# Altium project Level_Shield.PrjPcb
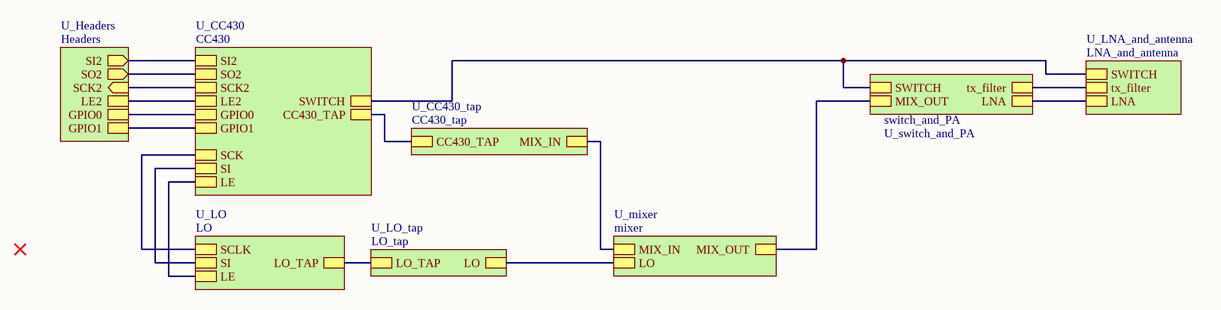
[diagram p0: Top.SchDoc]
9 sheets, 156 parts. Net scope: hierarchical (ports join the sheet entries above them; power ports are global).
Sheets:
  Top.SchDoc
    U_LNA_and_antenna = LNA_and_antenna.SchDoc
    U_switch_and_PA = switch_and_PA.SchDoc
    U_Headers = Headers.SchDoc
    U_CC430_tap = CC430_tap.SchDoc
    U_LO_tap = LO_tap.SchDoc
    U_CC430 = CC430.SchDoc
    U_LO = LO.SchDoc
    U_mixer = mixer.SchDoc

## Sheet Top.SchDoc
size A

### Sub-sheets
U_CC430 = CC430: CC430_TAP, SI, SCK, LE, SWITCH, SI2, SCK2, LE2, GPIO0, GPIO1, SO2
U_CC430_tap = CC430_tap: CC430_TAP, MIX_IN
U_Headers = Headers: SCK2 (in), SI2 (out), GPIO0, GPIO1, LE2, SO2 (out)
U_LNA_and_antenna = LNA_and_antenna: LNA, tx_filter, SWITCH
U_LO = LO: LO_TAP, SCLK, SI, LE
U_LO_tap = LO_tap: LO_TAP, LO
U_mixer = mixer: MIX_IN, MIX_OUT, LO
U_switch_and_PA = switch_and_PA: MIX_OUT, SWITCH, LNA, tx_filter

### Nets
NetC11_1: sheet U_CC430_tap/CC430_TAP, sheet U_CC430/CC430_TAP
NetC12_2: sheet U_CC430_tap/MIX_IN, sheet U_mixer/MIX_IN
NetC33_2: sheet U_LNA_and_antenna/LNA, sheet U_switch_and_PA/LNA
NetC40_2: sheet U_LNA_and_antenna/tx_filter, sheet U_switch_and_PA/tx_filter
NetC65_2: sheet U_LO_tap/LO_TAP, sheet U_LO/LO_TAP
NetC69_1: sheet U_LO_tap/LO, sheet U_mixer/LO
NetH1_1: sheet U_Headers/GPIO0, sheet U_CC430/GPIO0
NetH1_2: sheet U_Headers/GPIO1, sheet U_CC430/GPIO1
NetH1_3: sheet U_Headers/LE2, sheet U_CC430/LE2
NetH1_4: sheet U_Headers/SI2, sheet U_CC430/SI2
NetH1_5: sheet U_Headers/SO2, sheet U_CC430/SO2
NetH1_6: sheet U_Headers/SCK2, sheet U_CC430/SCK2
NetR17_1: sheet U_CC430/LE, sheet U_LO/LE
NetR18_1: sheet U_CC430/SCK, sheet U_LO/SCLK
NetR19_1: sheet U_CC430/SI, sheet U_LO/SI
NetU3_3: sheet U_LNA_and_antenna/SWITCH, sheet U_switch_and_PA/SWITCH, sheet U_CC430/SWITCH
NetU10_3: sheet U_switch_and_PA/MIX_OUT, sheet U_mixer/MIX_OUT

## Sheet LNA_and_antenna.SchDoc
size A
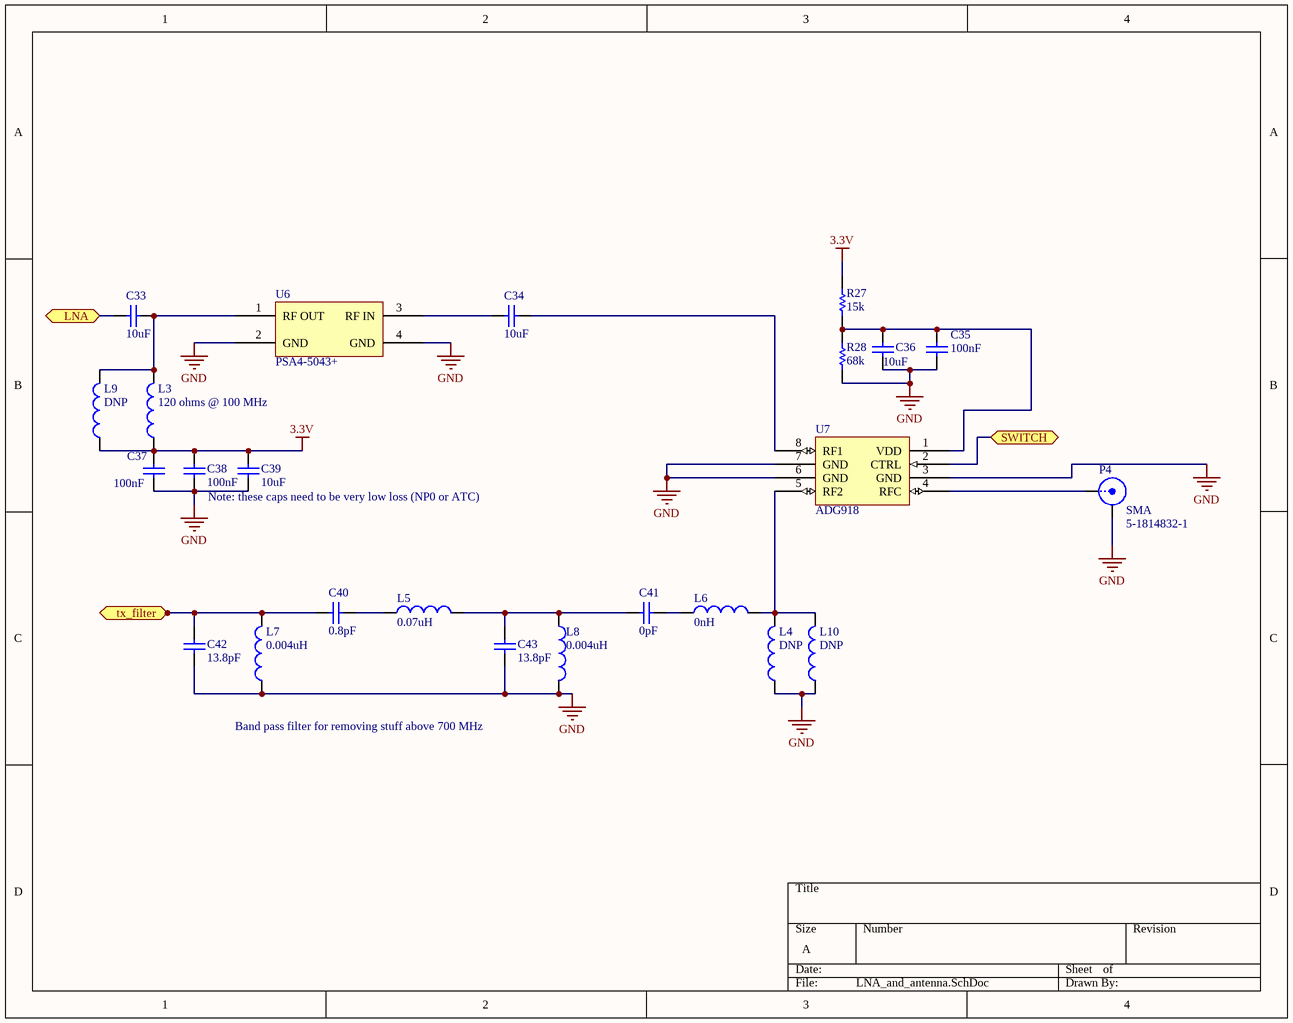
[diagram p1: LNA_and_antenna.SchDoc]

### Parts
C33  value 10uF  [0402]  (hidden comment: Cap Semi)
C34  value 10uF  [0402]  (hidden comment: Cap Semi)
C35  value 100nF  [0402]  (hidden comment: Cap Semi)
C36  value 10uF  [0402]  (hidden comment: Cap Semi)
C37  value 100nF  [0402]  (hidden comment: Cap Semi)
C38  value 100nF  [0402]  (hidden comment: Cap Semi)
C39  value 10uF  [0402]  (hidden comment: Cap Semi)
C40  value 0.8pF  [0402]  (hidden comment: Cap Semi)
C41  value 0pF  [0402]  (hidden comment: Cap Semi)
C42  value 13.8pF  [0402]  (hidden comment: Cap Semi)
C43  value 13.8pF  [0402]  (hidden comment: Cap Semi)
L3  value 120 ohms @ 100 MHz  [0402]  (hidden comment: Inductor)
L4  value DNP  [0402]  (hidden comment: Inductor)
L5  value 0.07uH  [0402]  (hidden comment: Inductor)
L6  value 0nH  [0402]  (hidden comment: Inductor)
L7  value 0.004uH  [0402]  (hidden comment: Inductor)
L8  value 0.004uH  [0402]  (hidden comment: Inductor)
L9  value DNP  [0402]  (hidden comment: Inductor)
L10  value DNP  [0402]  (hidden comment: Inductor)
P4  SMA  [SMB_V-RJ45]
R27  value 15k  [0402]  (hidden comment: Res Semi)
R28  value 68k  [0402]  (hidden comment: Res Semi)
U6  PSA4-5043+
U7  ADG918  [ADG918]

### Ports
LNA, SWITCH, tx_filter

### Nets
3.3V: C37.1 C38.1 C39.1 L3.1 L9.1 R27.1
GND: C35.1 C36.1 C37.2 C38.2 C39.2 C42.2 C43.2 L4.1 L7.1 L8.2 L10.1 P4.2(Y) R28.2 U6.2(GND) U6.4(GND) U7.3(GND) U7.6(GND) U7.7(GND)
NetC33_1: C33.1 L3.2 L9.2 U6.1(RF_OUT)
NetC33_2: C33.2 ; port LNA
NetC34_1: C34.1 U7.8(RF1)
NetC34_2: C34.2 U6.3(RF_IN)
NetC35_2: C35.2 C36.2 R27.2 R28.1 U7.1(VDD)
NetC40_1: C40.1 L5.1
NetC40_2: C40.2 C42.1 L7.2 ; port tx_filter
NetC41_1: C41.1 L6.1
NetC41_2: C41.2 C43.1 L5.2 L8.1
NetL4_2: L4.2 L6.2 L10.2 U7.5(RF2)
NetP4_1: P4.1(X) U7.4(RFC)
NetU3_3: U7.2(CTRL) ; port SWITCH

### Notes on the sheet
- Note: these caps need to be very low loss (NP0 or ATC)
- (near P4) 5-1814832-1
- Band pass filter for removing stuff above 700 MHz

### Library data of the parts
C33-C43 = Cap Semi: Capacitor (Semiconductor SIM Model); Published: 8-Jun-2000; LatestRevisionDate: 29-May-2009; LatestRevisionNote: IPC-7351 Footprint Added.; PackageReference: C1206; Publisher: Altium Limited; PackageDescription: Chip Capacitor
L3-L10 = Inductor: Code_IEC: 1005; Published: 8-Jun-2000; LatestRevisionDate: 29-May-2009; LatestRevisionNote: IPC-7351 Footprint Added.; PackageReference: 0402-A; Publisher: Altium Limited; PackageDescription: Chip Inductor; Code_JEITA: 0402
P4 = SMB: SMB Straight Connector; LatestRevisionDate: 17-Jul-2002; LatestRevisionNote: Re-released for DXP Platform.; Publisher: Altium Limited
R27 R28 = Res Semi: Semiconductor Resistor; Published: 8-Jun-2000; LatestRevisionDate: 17-Jul-2002; LatestRevisionNote: Re-released for DXP Platform.; PackageReference: AXIAL-0.5; Publisher: Altium Limited; PackageDescription: Axial Device, Thru-Hole; 2 Leads; 0.5 in Pin Spacing
U6 = PSA4-5043+: LNA
U7 = ADG918: RF Switch; Manufacturer: Analog Devices Inc; Manufacturer Part Number: ADG918BRMZ; Description: IC SW ONE HS SPDT 1.6/2.7V 8MSOP; RF Type: General Purpose; Frequency: 0Hz ~ 2GHz; ComponentLink1URL: http://www.analog.com/static/imported-files/data_sheets/ADG918_919.pdf; ComponentLink1Description: Datasheet for ADG918; Supplier 1: Digi-Key; RoHS: RoHS Compliant; Category: RF/IF and RFID; Stock 1: 5696; Pricing 1: 1=2.75, 10=2.453, 25=2.2072, 100=2.0111, 250=1.81484, 500=1.62846, 1000=1.3734, 2500=1.308 (USD); Features: SPDT; Package / Case: 8-TSSOP, 8-MSOP (0.118", 3.00mm Width); Supplier Device Package: 8-MSOP; Packaging: Tube; Supplier Part Number 1: ADG918BRMZ-ND

## Sheet switch_and_PA.SchDoc
size A
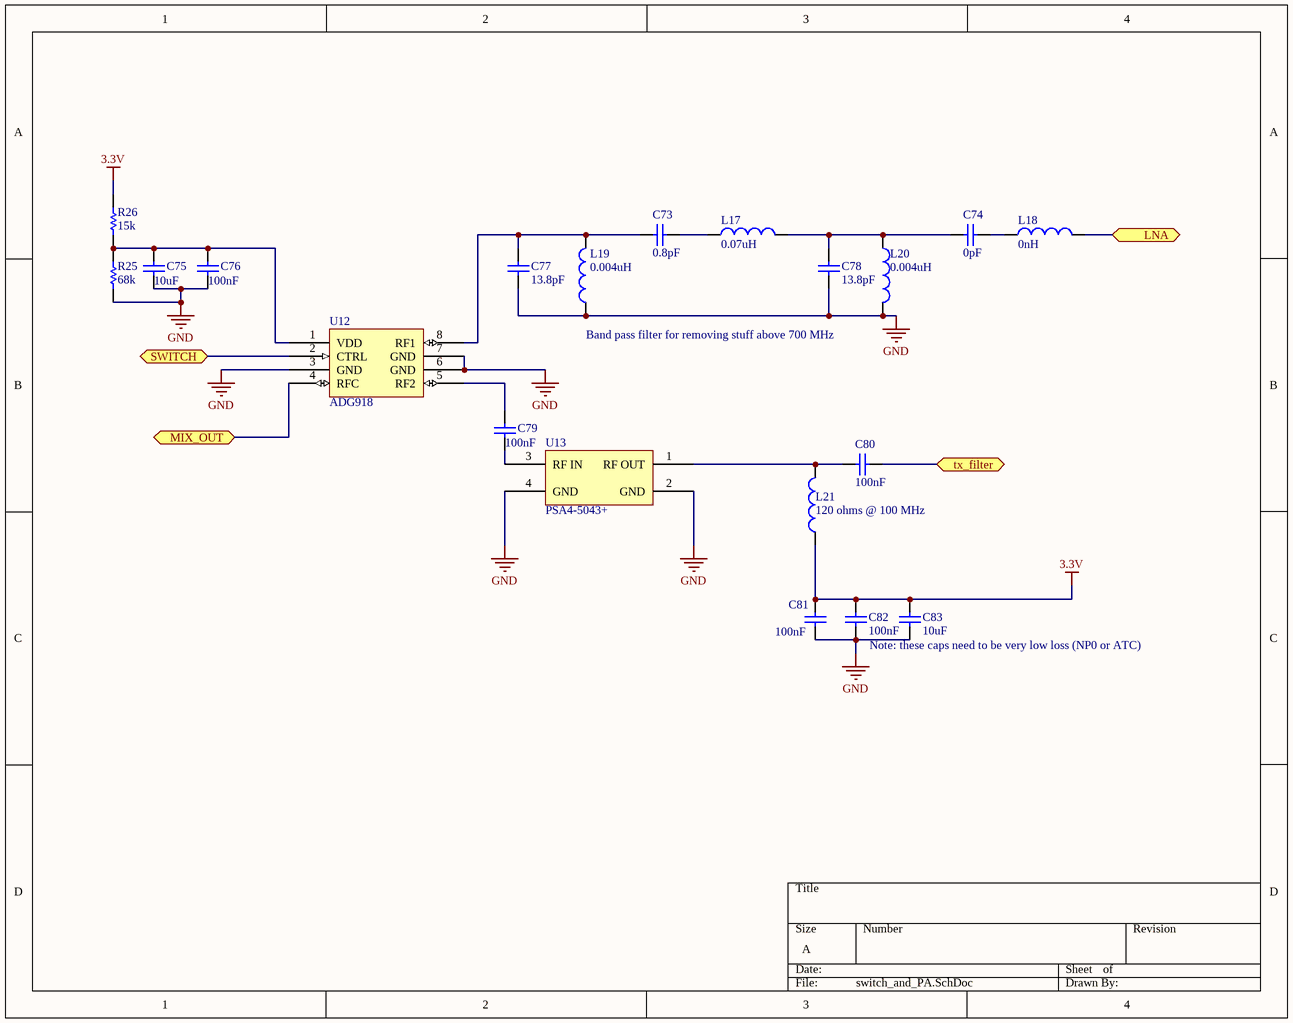
[diagram p2: switch_and_PA.SchDoc]

### Parts
C73  value 0.8pF  [0402]  (hidden comment: Cap Semi)
C74  value 0pF  [0402]  (hidden comment: Cap Semi)
C75  value 10uF  [0402]  (hidden comment: Cap Semi)
C76  value 100nF  [0402]  (hidden comment: Cap Semi)
C77  value 13.8pF  [0402]  (hidden comment: Cap Semi)
C78  value 13.8pF  [0402]  (hidden comment: Cap Semi)
C79  value 100nF  [0402]  (hidden comment: Cap Semi)
C80  value 100nF  [0402]  (hidden comment: Cap Semi)
C81  value 100nF  [0402]  (hidden comment: Cap Semi)
C82  value 100nF  [0402]  (hidden comment: Cap Semi)
C83  value 10uF  [0402]  (hidden comment: Cap Semi)
L17  value 0.07uH  [0402]  (hidden comment: Inductor)
L18  value 0nH  [0402]  (hidden comment: Inductor)
L19  value 0.004uH  [0402]  (hidden comment: Inductor)
L20  value 0.004uH  [0402]  (hidden comment: Inductor)
L21  value 120 ohms @ 100 MHz  [0402]  (hidden comment: Inductor)
R25  value 68k  [0402]  (hidden comment: Res Semi)
R26  value 15k  [0402]  (hidden comment: Res Semi)
U12  ADG918  [ADG918]
U13  PSA4-5043+

### Ports
LNA, MIX_OUT, SWITCH, tx_filter

### Nets
3.3V: C81.1 C82.1 C83.1 L21.1 R26.1
GND: C75.1 C76.1 C77.2 C78.2 C81.2 C82.2 C83.2 L19.1 L20.2 R25.2 U12.3(GND) U12.6(GND) U12.7(GND) U13.2(GND) U13.4(GND)
NetC33_2: L18.2 ; port LNA
NetC40_2: C80.1 ; port tx_filter
NetC73_1: C73.1 L17.1
NetC73_2: C73.2 C77.1 L19.2 U12.8(RF1)
NetC74_1: C74.1 L18.1
NetC74_2: C74.2 C78.1 L17.2 L20.1
NetC75_2: C75.2 C76.2 R25.1 R26.2 U12.1(VDD)
NetC79_1: C79.1 U13.3(RF_IN)
NetC79_2: C79.2 U12.5(RF2)
NetC80_2: C80.2 L21.2 U13.1(RF_OUT)
NetU3_3: U12.2(CTRL) ; port SWITCH
NetU10_3: U12.4(RFC) ; port MIX_OUT

### Notes on the sheet
- Band pass filter for removing stuff above 700 MHz
- Note: these caps need to be very low loss (NP0 or ATC)

### Library data of the parts
C73-C83 = Cap Semi: Capacitor (Semiconductor SIM Model); Published: 8-Jun-2000; LatestRevisionDate: 29-May-2009; LatestRevisionNote: IPC-7351 Footprint Added.; PackageReference: C1206; Publisher: Altium Limited; PackageDescription: Chip Capacitor
L17-L21 = Inductor: Code_IEC: 1005; Published: 8-Jun-2000; LatestRevisionDate: 29-May-2009; LatestRevisionNote: IPC-7351 Footprint Added.; PackageReference: 0402-A; Publisher: Altium Limited; PackageDescription: Chip Inductor; Code_JEITA: 0402
R25 R26 = Res Semi: Semiconductor Resistor; Published: 8-Jun-2000; LatestRevisionDate: 17-Jul-2002; LatestRevisionNote: Re-released for DXP Platform.; PackageReference: AXIAL-0.5; Publisher: Altium Limited; PackageDescription: Axial Device, Thru-Hole; 2 Leads; 0.5 in Pin Spacing
U12 = ADG918: as U7 on sheet LNA_and_antenna; ComponentLink1URL: http://www.analog.com/static/imported-files/data_sheets/ADG918_919.pdf; ComponentLink1Description: Datasheet for ADG918; Supplier 1: Digi-Key; RoHS: RoHS Compliant; Category: RF/IF and RFID; Stock 1: 5696; Pricing 1: 1=2.75, 10=2.453, 25=2.2072, 100=2.0111, 250=1.81484, 500=1.62846, 1000=1.3734, 2500=1.308 (USD); Features: SPDT; Package / Case: 8-TSSOP, 8-MSOP (0.118", 3.00mm Width); Supplier Device Package: 8-MSOP; Packaging: Tube; Supplier Part Number 1: ADG918BRMZ-ND
U13 = PSA4-5043+: LNA

## Sheet Headers.SchDoc
size A
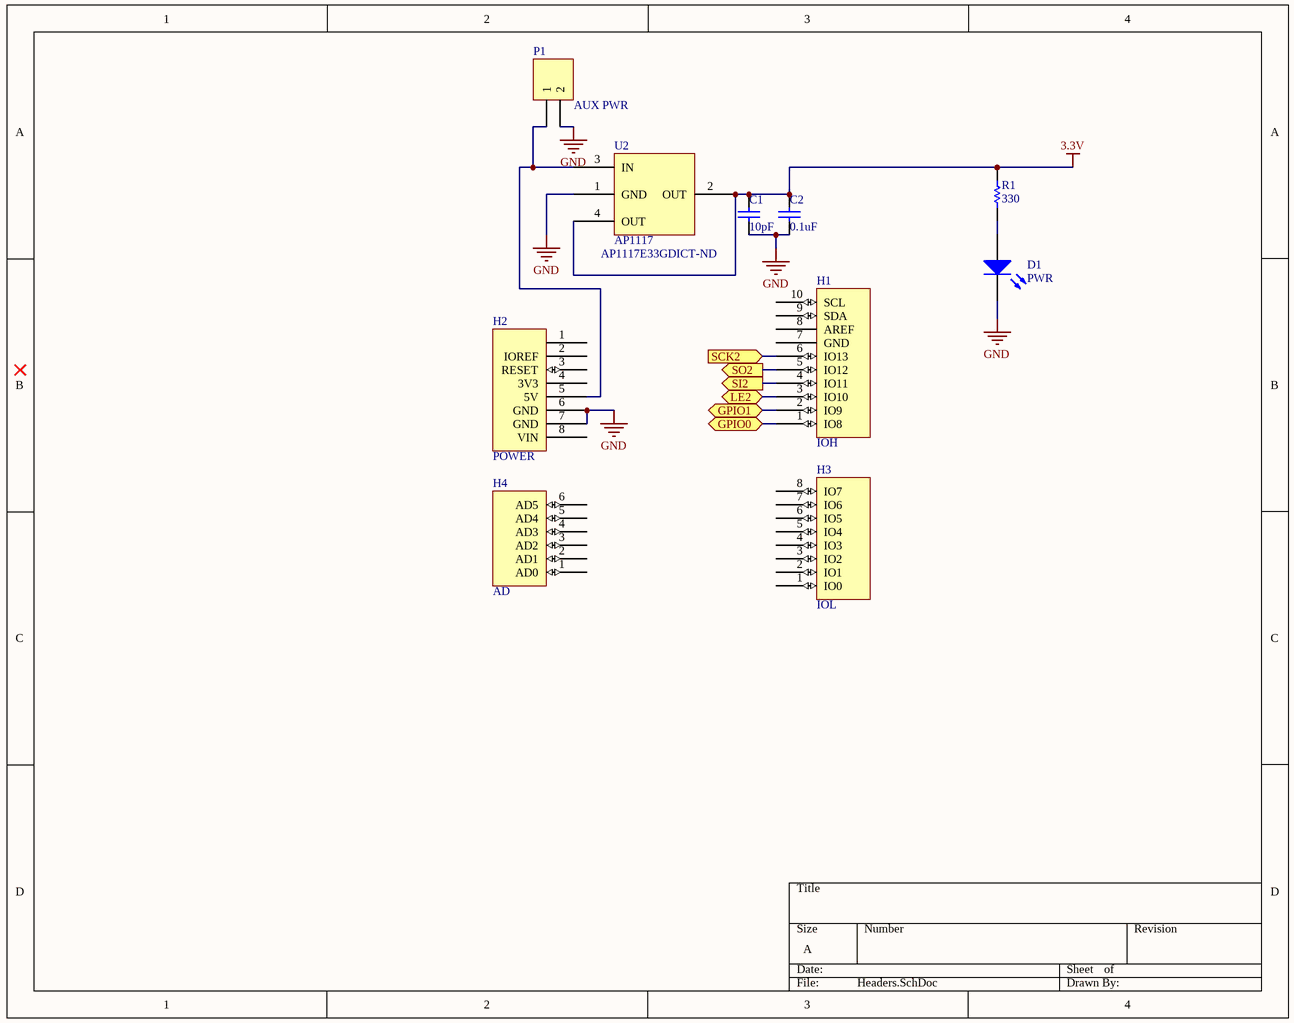
[diagram p3: Headers.SchDoc]

### Parts
C1  value 10pF  [0402]  (hidden comment: Cap Semi)
C2  value 0.1uF  [0402]  (hidden comment: Cap Semi)
D1  PWR  [0603]
H1  IOH  [Header 10x1 8.5mm]
H2  POWER  [Header 8x1 8.5mm]
H3  IOL  [Header 8x1 8.5mm]
H4  AD  [Header 6x1 8.5mm]
P1  AUX PWR  [HDR1X2]
R1  value 330  [0402]  (hidden comment: Res Semi)
U2  AP1117

### Ports
GPIO0, GPIO1, LE2, SCK2 (in), SI2 (out), SO2 (out)

### Nets
3.3V: C1.1 C2.1 R1.2 U2.2(OUT) U2.4(OUT)
GND: C1.2 C2.2 D1.2(K) H2.6(GND) H2.7(GND) P1.2 U2.1(GND)
NetD1_1: D1.1(A) R1.1
NetH1_1: H1.1(IO8) ; port GPIO0
NetH1_2: H1.2(IO9) ; port GPIO1
NetH1_3: H1.3(IO10) ; port LE2
NetH1_4: H1.4(IO11) ; port SI2
NetH1_5: H1.5(IO12) ; port SO2
NetH1_6: H1.6(IO13) ; port SCK2
NetH2_5: H2.5(5V) P1.1 U2.3(IN)

Not connected (* = marked no-connect by the designer): H1 7(GND) 8(AREF) 9(SDA) 10(SCL); H2 1 2(IOREF) 3(RESET) 4(3V3) 8(VIN); H3 1(IO0) 2(IO1) 3(IO2) 4(IO3) 5(IO4) 6(IO5) 7(IO6) 8(IO7); H4 1(AD0) 2(AD1) 3(AD2) 4(AD3) 5(AD4) 6(AD5)

### Notes on the sheet
- (near U2) AP1117E33GDICT-ND

### Library data of the parts
C1 C2 = Cap Semi: Capacitor (Semiconductor SIM Model); Published: 8-Jun-2000; LatestRevisionDate: 29-May-2009; LatestRevisionNote: IPC-7351 Footprint Added.; PackageReference: C1206; Publisher: Altium Limited; PackageDescription: Chip Capacitor
D1 = LED2: Typical RED, GREEN, YELLOW, AMBER GaAs LED; Published: 8-Jun-2000; LatestRevisionDate: 17-Jul-2002; LatestRevisionNote: Re-released for DXP Platform.; PackageVersion: Feb-2002; PackageReference: 3.2X1.6X1.1; Publisher: Altium Limited; PackageDescription: SM LED; 2 Flat Leads
P1 = Header 2: Header, 2-Pin; LatestRevisionDate: 17-Jul-2002; LatestRevisionNote: Re-released for DXP Platform.; Publisher: Altium Limited
R1 = Res Semi: Semiconductor Resistor; Published: 8-Jun-2000; LatestRevisionDate: 17-Jul-2002; LatestRevisionNote: Re-released for DXP Platform.; PackageReference: AXIAL-0.5; Publisher: Altium Limited; PackageDescription: Axial Device, Thru-Hole; 2 Leads; 0.5 in Pin Spacing

## Sheet CC430_tap.SchDoc
size A
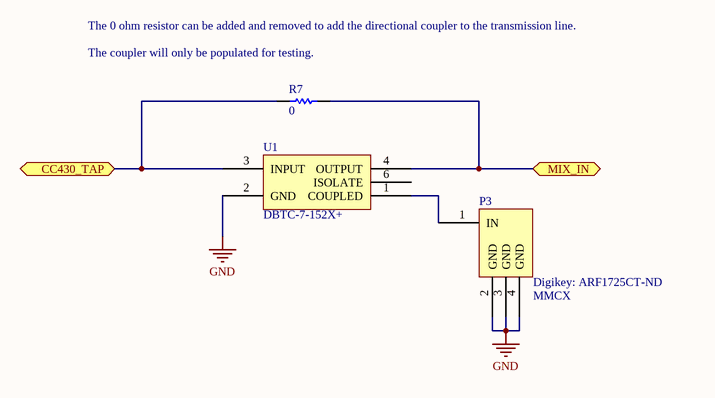
[diagram p4: CC430_tap.SchDoc]

### Parts
P3  MMCX
R7  value 0  [0402]  (hidden comment: Res Semi)
U1  DBTC-7-152X+

### Ports
CC430_TAP, MIX_IN

### Nets
GND: P3.2(GND) P3.3(GND) P3.4(GND) U1.2(GND)
NetC11_1: R7.2 U1.3(INPUT) ; port CC430_TAP
NetC12_2: R7.1 U1.4(OUTPUT) ; port MIX_IN
NetP3_1: P3.1(IN) U1.1(COUPLED)

Not connected (* = marked no-connect by the designer): U1 6(ISOLATE)

### Notes on the sheet
- The 0 ohm resistor can be added and removed to add the directional coupler to the transmission line.
- (near R7) The coupler will only be populated for testing.
- (near P3) Digikey: ARF1725CT-ND

### Library data of the parts
R7 = Res Semi: Semiconductor Resistor; Published: 8-Jun-2000; LatestRevisionDate: 17-Jul-2002; LatestRevisionNote: Re-released for DXP Platform.; PackageReference: AXIAL-0.5; Publisher: Altium Limited; PackageDescription: Axial Device, Thru-Hole; 2 Leads; 0.5 in Pin Spacing

## Sheet LO_tap.SchDoc
size A
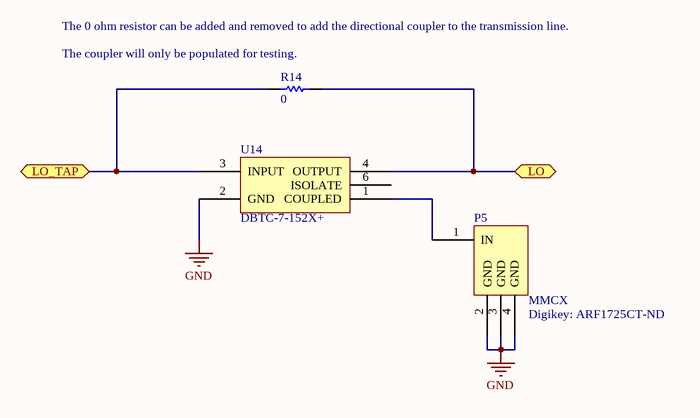
[diagram p5: LO_tap.SchDoc]

### Parts
P5  MMCX
R14  value 0  [0402]  (hidden comment: Res Semi)
U14  DBTC-7-152X+

### Ports
LO, LO_TAP

### Nets
GND: P5.2(GND) P5.3(GND) P5.4(GND) U14.2(GND)
NetC65_2: R14.2 U14.3(INPUT) ; port LO_TAP
NetC69_1: R14.1 U14.4(OUTPUT) ; port LO
NetP5_1: P5.1(IN) U14.1(COUPLED)

Not connected (* = marked no-connect by the designer): U14 6(ISOLATE)

### Notes on the sheet
- The 0 ohm resistor can be added and removed to add the directional coupler to the transmission line.
- (near R14) The coupler will only be populated for testing.
- (near P5) Digikey: ARF1725CT-ND

### Library data of the parts
R14 = Res Semi: Semiconductor Resistor; Published: 8-Jun-2000; LatestRevisionDate: 17-Jul-2002; LatestRevisionNote: Re-released for DXP Platform.; PackageReference: AXIAL-0.5; Publisher: Altium Limited; PackageDescription: Axial Device, Thru-Hole; 2 Leads; 0.5 in Pin Spacing

## Sheet CC430.SchDoc
size A
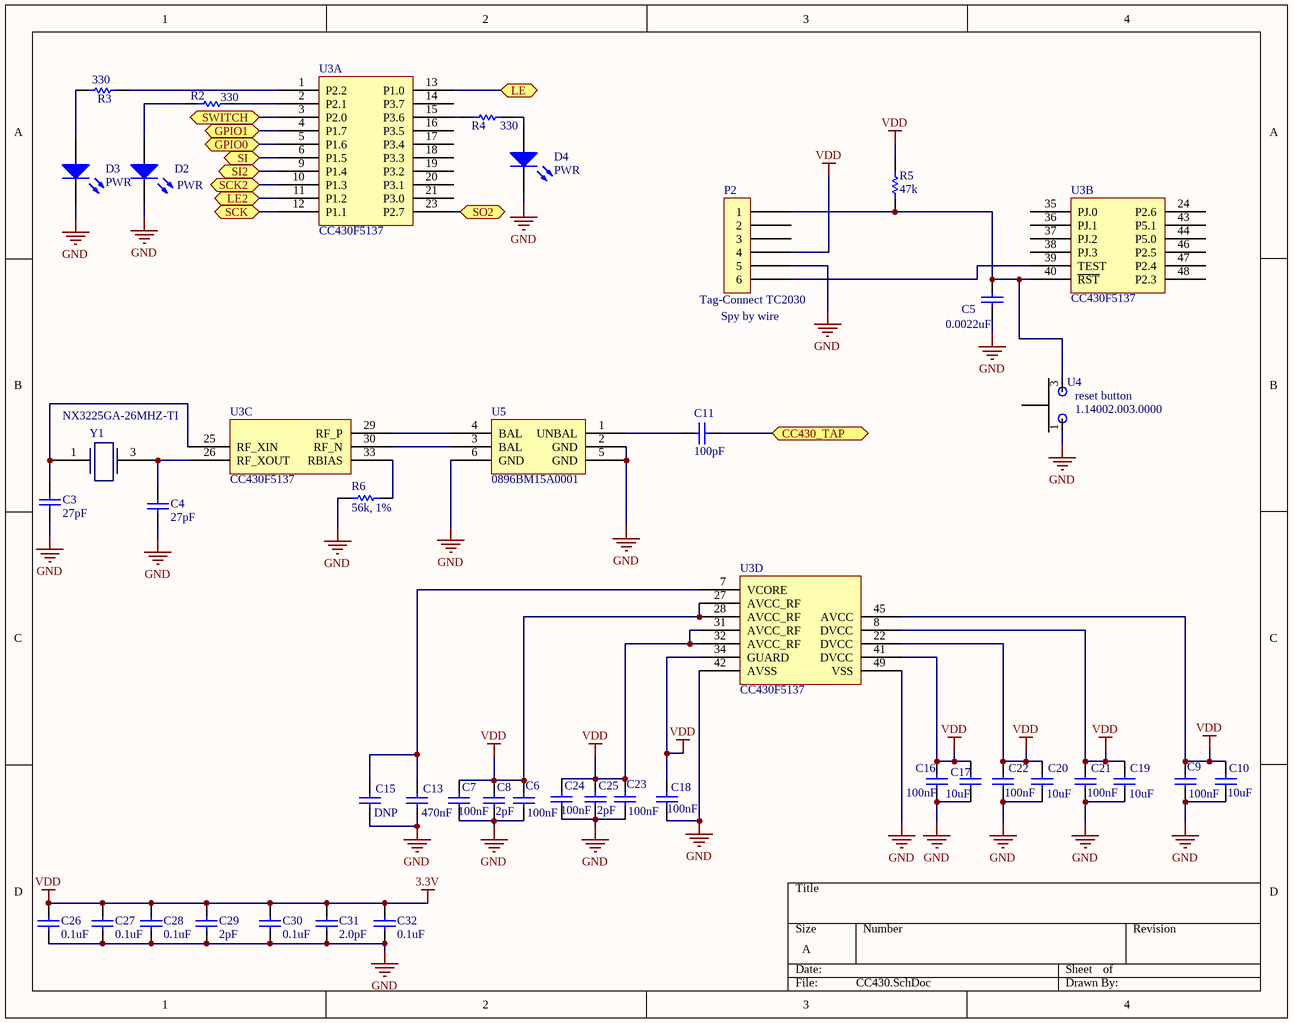
[diagram p6: CC430.SchDoc]

### Parts
C3  value 27pF  [0402]  (hidden comment: Cap Semi)
C4  value 27pF  [0402]  (hidden comment: Cap Semi)
C5  value 0.0022uF  [0402]  (hidden comment: Cap Semi)
C6  value 100nF  [0402]  (hidden comment: Cap Semi)
C7  value 100nF  [0402]  (hidden comment: Cap Semi)
C8  value 2pF  [0402]  (hidden comment: Cap Semi)
C9  value 100nF  [0402]  (hidden comment: Cap Semi)
C10  value 10uF  [0402]  (hidden comment: Cap Semi)
C11  value 100pF  [0402]  (hidden comment: Cap Semi)
C13  value 470nF  [0402]  (hidden comment: Cap Semi)
C15  value DNP  [0402]  (hidden comment: Cap Semi)
C16  value 100nF  [0402]  (hidden comment: Cap Semi)
C17  value 10uF  [0402]  (hidden comment: Cap Semi)
C18  value 100nF  [0402]  (hidden comment: Cap Semi)
C19  value 10uF  [0402]  (hidden comment: Cap Semi)
C20  value 10uF  [0402]  (hidden comment: Cap Semi)
C21  value 100nF  [0402]  (hidden comment: Cap Semi)
C22  value 100nF  [0402]  (hidden comment: Cap Semi)
C23  value 100nF  [0402]  (hidden comment: Cap Semi)
C24  value 100nF  [0402]  (hidden comment: Cap Semi)
C25  value 2pF  [0402]  (hidden comment: Cap Semi)
C26  value 0.1uF  [0402]  (hidden comment: Cap Semi)
C27  value 0.1uF  [0402]  (hidden comment: Cap Semi)
C28  value 0.1uF  [0402]  (hidden comment: Cap Semi)
C29  value 2pF  [0402]  (hidden comment: Cap Semi)
C30  value 0.1uF  [0402]  (hidden comment: Cap Semi)
C31  value 2.0pF  [0402]  (hidden comment: Cap Semi)
C32  value 0.1uF  [0402]  (hidden comment: Cap Semi)
D2  PWR  [0603]
D3  PWR  [0603]
D4  PWR  [0603]
P2  Tag-Connect TC2030
R2  value 330  [0402]  (hidden comment: Res Semi)
R3  value 330  [0402]  (hidden comment: Res Semi)
R4  value 330  [0402]  (hidden comment: Res Semi)
R5  value 47k  [0402]  (hidden comment: Res Semi)
R6  value 56k, 1%  [0402]  (hidden comment: Res Semi)
U3  CC430F5137  (parts A,B,C,D of 4)
U4  reset button
U5  0896BM15A0001
Y1  NX3225GA-26MHZ-TI

### Ports
CC430_TAP, GPIO0, GPIO1, LE, LE2, SCK, SCK2, SI, SI2, SO2, SWITCH

### Nets
3.3V: C6.1 C7.1 C8.1 C9.1 C10.1 C16.1 C17.1 C18.1 C19.1 C20.1 C21.1 C22.1 C23.1 C24.1 C25.1 C26.1 C27.1 C28.1 C29.1 C30.1 C31.1 C32.1 P2.?4(4) R5.1 U3.8(DVCC) U3.22(DVCC) U3.27(AVCC_RF) U3.28(AVCC_RF) U3.31(AVCC_RF) U3.32(AVCC_RF) U3.34(GUARD) U3.41(DVCC) U3.45(AVCC)  [also labelled VDD]
GND: C3.2 C4.2 C5.2 C6.2 C7.2 C8.2 C9.2 C10.2 C13.2 C15.2 C16.2 C17.2 C18.2 C19.2 C20.2 C21.2 C22.2 C23.2 C24.2 C25.2 C26.2 C27.2 C28.2 C29.2 C30.2 C31.2 C32.2 D2.2(K) D3.2(K) D4.2(K) P2.?5(5) R6.1 U3.42(AVSS) U3.49(VSS) U4.1 U5.2(GND) U5.5(GND) U5.6(GND)
NetC3_1: C3.1 U3.25(RF_XIN) Y1.1
NetC4_1: C4.1 U3.26(RF_XOUT) Y1.3
NetC5_1: C5.1 P2.?1(1) R5.2 U3.40(~{RST}) U4.3
NetC11_1: C11.1 ; port CC430_TAP
NetC11_2: C11.2 U5.1(UNBAL)
NetC13_1: C13.1 C15.1 U3.7(VCORE)
NetD2_1: D2.1(A) R2.2
NetD3_1: D3.1(A) R3.2
NetD4_1: D4.1(A) R4.1
NetH1_1: U3.5(P1.6) ; port GPIO0
NetH1_2: U3.4(P1.7) ; port GPIO1
NetH1_3: U3.11(P1.2) ; port LE2
NetH1_4: U3.9(P1.4) ; port SI2
NetH1_5: U3.23(P2.7) ; port SO2
NetH1_6: U3.10(P1.3) ; port SCK2
NetP2_?6: P2.?6(6) U3.39(TEST)
NetR2_1: R2.1 U3.2(P2.1)
NetR3_1: R3.1 U3.1(P2.2)
NetR4_2: R4.2 U3.15(P3.6)
NetR6_2: R6.2 U3.33(RBIAS)
NetR17_1: U3.13(P1.0) ; port LE
NetR18_1: U3.12(P1.1) ; port SCK
NetR19_1: U3.6(P1.5) ; port SI
NetU3_3: U3.3(P2.0) ; port SWITCH
NetU3_29: U3.29(RF_P) U5.4(BAL)
NetU3_30: U3.30(RF_N) U5.3(BAL)

Not connected (* = marked no-connect by the designer): P2 ?2(2) ?3(3); U3 14(P3.7) 16(P3.5) 17(P3.4) 18(P3.3) 19(P3.2) 20(P3.1) 21(P3.0) 24(P2.6) 35(PJ.0) 36(PJ.1) 37(PJ.2) 38(PJ.3) 43(P5.1) 44(P5.0) 46(P2.5) 47(P2.4) 48(P2.3)

### Notes on the sheet
- (near P2) Spy by wire
- (near U4) 1.14002.003.0000

### Library data of the parts
C3-C11 C13 C15-C32 = Cap Semi: Capacitor (Semiconductor SIM Model); Published: 8-Jun-2000; LatestRevisionDate: 29-May-2009; LatestRevisionNote: IPC-7351 Footprint Added.; PackageReference: C1206; Publisher: Altium Limited; PackageDescription: Chip Capacitor
D2-D4 = LED2: as D1 on sheet Headers; Published: 8-Jun-2000; LatestRevisionDate: 17-Jul-2002; LatestRevisionNote: Re-released for DXP Platform.; PackageVersion: Feb-2002; PackageReference: 3.2X1.6X1.1; Publisher: Altium Limited; PackageDescription: SM LED; 2 Flat Leads
P2 = tag-connect
R2-R6 = Res Semi: Semiconductor Resistor; Published: 8-Jun-2000; LatestRevisionDate: 17-Jul-2002; LatestRevisionNote: Re-released for DXP Platform.; PackageReference: AXIAL-0.5; Publisher: Altium Limited; PackageDescription: Axial Device, Thru-Hole; 2 Leads; 0.5 in Pin Spacing
U5 = 0896BM15A0001: Balun

## Sheet LO.SchDoc
size A
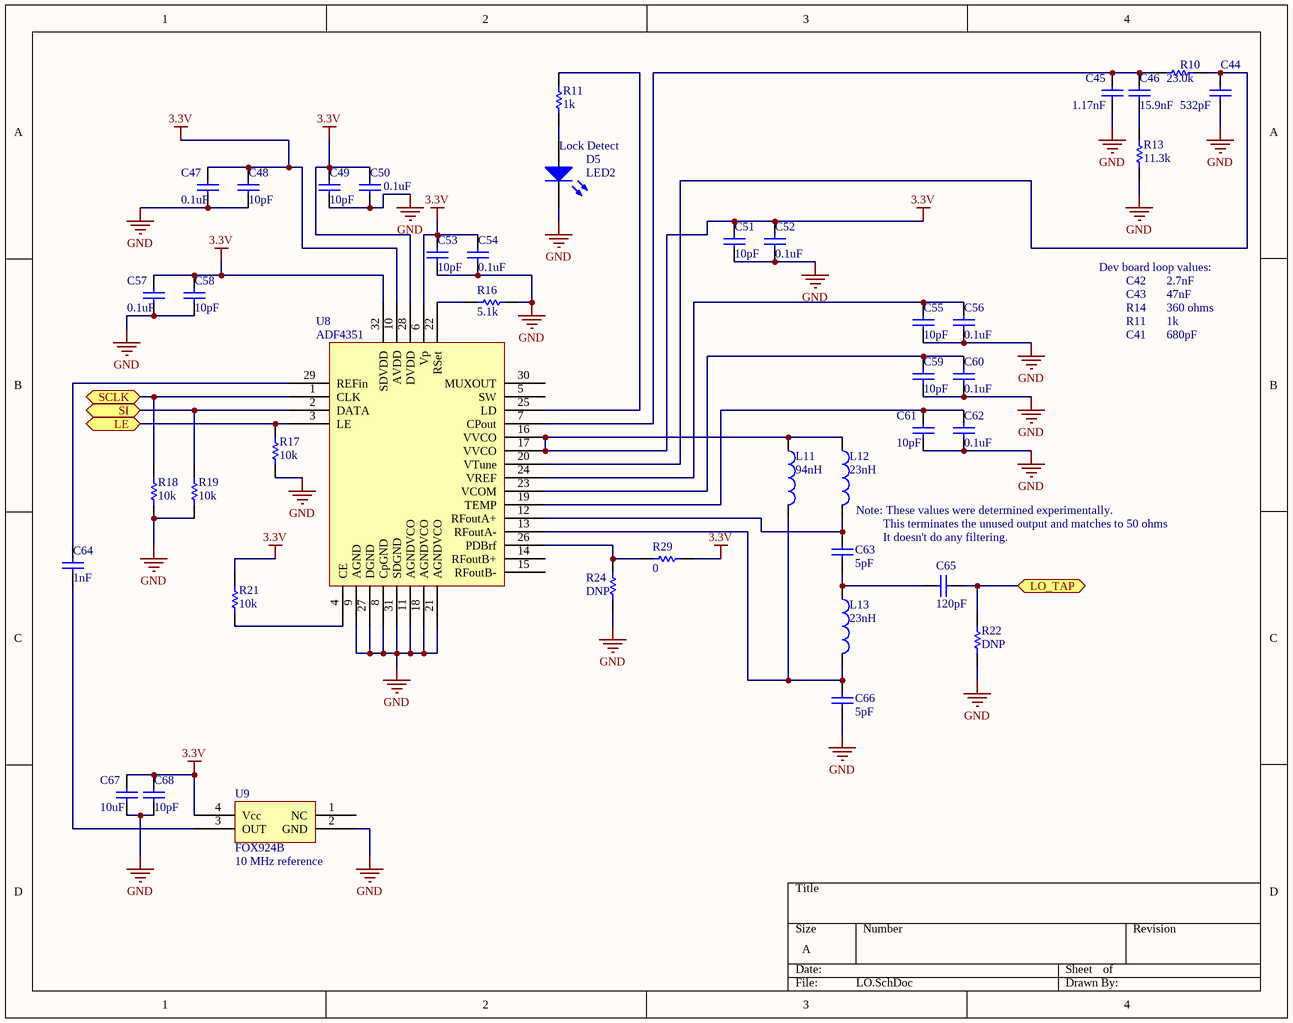
[diagram p7: LO.SchDoc]

### Parts
C44  value 532pF  [0402]  (hidden comment: Cap Semi)
C45  value 1.17nF  [0402]  (hidden comment: Cap Semi)
C46  value 15.9nF  [0402]  (hidden comment: Cap Semi)
C47  value 0.1uF  [0402]  (hidden comment: Cap Semi)
C48  value 10pF  [0402]  (hidden comment: Cap Semi)
C49  value 10pF  [0402]  (hidden comment: Cap Semi)
C50  value 0.1uF  [0402]  (hidden comment: Cap Semi)
C51  value 10pF  [0402]  (hidden comment: Cap Semi)
C52  value 0.1uF  [0402]  (hidden comment: Cap Semi)
C53  value 10pF  [0402]  (hidden comment: Cap Semi)
C54  value 0.1uF  [0402]  (hidden comment: Cap Semi)
C55  value 10pF  [0402]  (hidden comment: Cap Semi)
C56  value 0.1uF  [0402]  (hidden comment: Cap Semi)
C57  value 0.1uF  [0402]  (hidden comment: Cap Semi)
C58  value 10pF  [0402]  (hidden comment: Cap Semi)
C59  value 10pF  [0402]  (hidden comment: Cap Semi)
C60  value 0.1uF  [0402]  (hidden comment: Cap Semi)
C61  value 10pF  [0402]  (hidden comment: Cap Semi)
C62  value 0.1uF  [0402]  (hidden comment: Cap Semi)
C63  value 5pF  [0402]  (hidden comment: Cap Semi)
C64  value 1nF  [0402]  (hidden comment: Cap Semi)
C65  value 120pF  [0402]  (hidden comment: Cap Semi)
C66  value 5pF  [0402]  (hidden comment: Cap Semi)
C67  value 10uF  [0402]  (hidden comment: Cap Semi)
C68  value 10pF  [0402]  (hidden comment: Cap Semi)
D5  LED2  [0603]
L11  value 94nH  [0402]  (hidden comment: Inductor)
L12  value 23nH  [0402]  (hidden comment: Inductor)
L13  value 23nH  [0402]  (hidden comment: Inductor)
R10  value 23.0k  [0402]  (hidden comment: Res Semi)
R11  value 1k  [0402]  (hidden comment: Res Semi)
R13  value 11.3k  [0402]  (hidden comment: Res Semi)
R16  value 5.1k  [0402]  (hidden comment: Res Semi)
R17  value 10k  [0402]  (hidden comment: Res Semi)
R18  value 10k  [0402]  (hidden comment: Res Semi)
R19  value 10k  [0402]  (hidden comment: Res Semi)
R21  value 10k  [0402]  (hidden comment: Res Semi)
R22  value DNP  [0402]  (hidden comment: Res Semi)
R24  value DNP  [0402]  (hidden comment: Res Semi)
R29  value 0  [0402]  (hidden comment: Res Semi)
U8  ADF4351  [QFN50P500X500-32VBN]
U9  FOX924B  [FOX924]

### Ports
LE, LO_TAP, SCLK, SI

### Nets
3.3V: C47.1 C48.1 C49.1 C50.1 C51.1 C52.1 C53.1 C54.1 C57.1 C58.1 C67.1 C68.1 L11.1 L12.1 R21.1 R29.2 U8.6(Vp) U8.10(AVDD) U8.16(VVCO) U8.17(VVCO) U8.28(DVDD) U8.32(SDVDD) U9.4(Vcc)
GND: C44.2 C45.2 C47.2 C48.2 C49.2 C50.2 C51.2 C52.2 C53.2 C54.2 C55.2 C56.2 C57.2 C58.2 C59.2 C60.2 C61.2 C62.2 C66.2 C67.2 C68.2 D5.2(K) R13.2 R16.1 R17.2 R18.2 R19.2 R22.2 R24.2 U8.8(CpGND) U8.9(AGND) U8.11(AGNDVCO) U8.18(AGNDVCO) U8.21(AGNDVCO) U8.27(DGND) U8.31(SDGND) U9.2(GND)
NetC44_1: C44.1 R10.1 U8.20(VTune)
NetC45_1: C45.1 C46.1 R10.2 U8.7(CPout)
NetC46_2: C46.2 R13.1
NetC55_1: C55.1 C56.1 U8.24(VREF)
NetC59_1: C59.1 C60.1 U8.23(VCOM)
NetC61_1: C61.1 C62.1 U8.19(TEMP)
NetC63_1: C63.1 L12.2 U8.12(RFoutA+)
NetC63_2: C63.2 C65.1 L13.1
NetC64_1: C64.1 U8.29(REFin)
NetC64_2: C64.2 U9.3(OUT)
NetC65_2: C65.2 R22.1 ; port LO_TAP
NetC66_1: C66.1 L11.2 L13.2 U8.13(RFoutA-)
NetD5_1: D5.1(A) R11.2
NetR11_1: R11.1 U8.25(LD)
NetR16_2: R16.2 U8.22(RSet)
NetR17_1: R17.1 U8.3(LE) ; port LE
NetR18_1: R18.1 U8.1(CLK) ; port SCLK
NetR19_1: R19.1 U8.2(DATA) ; port SI
NetR21_2: R21.2 U8.4(CE)
NetR24_1: R24.1 R29.1 U8.26(PDBrf)

Not connected (* = marked no-connect by the designer): U8 5(SW) 14(RFoutB+) 15(RFoutB-) 30(MUXOUT); U9 1(NC)

### Notes on the sheet
- (near D5) Lock Detect
- Dev board loop values:
- C42
- C43
- 2.7nF
- 47nF
- R14
- R11
- C41
- 360 ohms
- 1k
- 680pF
- (near L12) Note: These values were determined experimentally.
- This terminates the unused output and matches to 50 ohms
- It doesn't do any filtering.
- (near U9) 10 MHz reference

### Library data of the parts
C44-C68 = Cap Semi: Capacitor (Semiconductor SIM Model); Published: 8-Jun-2000; LatestRevisionDate: 29-May-2009; LatestRevisionNote: IPC-7351 Footprint Added.; PackageReference: C1206; Publisher: Altium Limited; PackageDescription: Chip Capacitor
D5 = LED2: as D1 on sheet Headers; Published: 8-Jun-2000; LatestRevisionDate: 17-Jul-2002; LatestRevisionNote: Re-released for DXP Platform.; PackageVersion: Feb-2002; PackageReference: 3.2X1.6X1.1; Publisher: Altium Limited; PackageDescription: SM LED; 2 Flat Leads
L11-L13 = Inductor: Code_IEC: 1005; Published: 8-Jun-2000; LatestRevisionDate: 29-May-2009; LatestRevisionNote: IPC-7351 Footprint Added.; PackageReference: 0402-A; Publisher: Altium Limited; PackageDescription: Chip Inductor; Code_JEITA: 0402
R10 R11 R13 R16-R19 R21 R22 R24 R29 = Res Semi: Semiconductor Resistor; Published: 8-Jun-2000; LatestRevisionDate: 17-Jul-2002; LatestRevisionNote: Re-released for DXP Platform.; PackageReference: AXIAL-0.5; Publisher: Altium Limited; PackageDescription: Axial Device, Thru-Hole; 2 Leads; 0.5 in Pin Spacing
U8 = ADF4350: VCO
U9 = FOX924

## Sheet mixer.SchDoc
size A
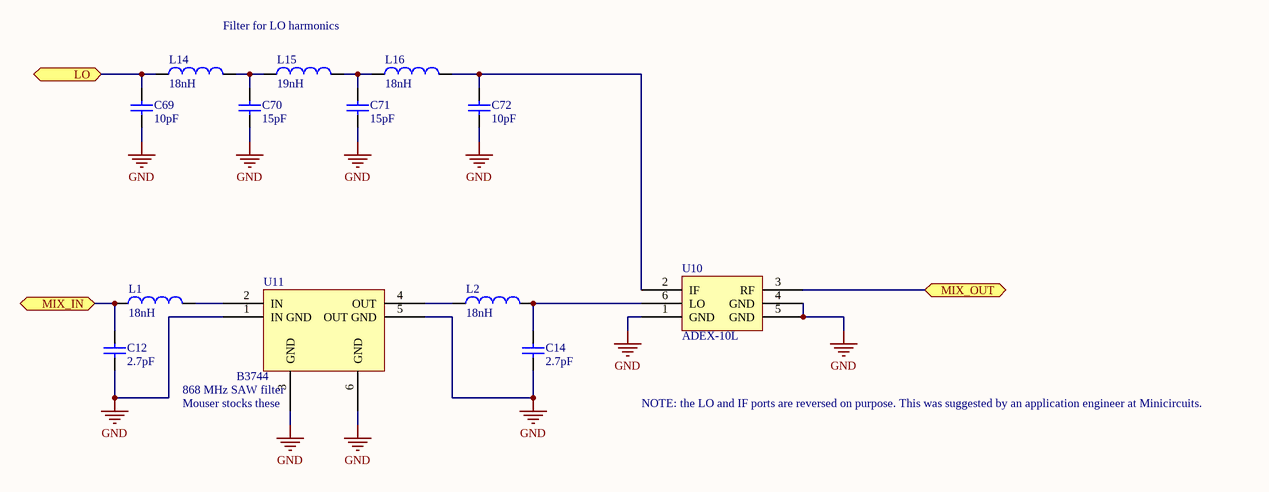
[diagram p8: mixer.SchDoc]

### Parts
C12  value 2.7pF  [0402]  (hidden comment: Cap Semi)
C14  value 2.7pF  [0402]  (hidden comment: Cap Semi)
C69  value 10pF  [0402]  (hidden comment: Cap Semi)
C70  value 15pF  [0402]  (hidden comment: Cap Semi)
C71  value 15pF  [0402]  (hidden comment: Cap Semi)
C72  value 10pF  [0402]  (hidden comment: Cap Semi)
L1  value 18nH  [0402]  (hidden comment: Inductor)
L2  value 18nH  [0402]  (hidden comment: Inductor)
L14  value 18nH  [0402]  (hidden comment: Inductor)
L15  value 19nH  [0402]  (hidden comment: Inductor)
L16  value 18nH  [0402]  (hidden comment: Inductor)
U10  ADEX-10L
U11  B3744

### Ports
LO, MIX_IN, MIX_OUT

### Nets
GND: C12.1 C14.2 C69.2 C70.2 C71.2 C72.2 U10.1(GND) U10.4(GND) U10.5(GND) U11.1(IN_GND) U11.3(GND) U11.5(OUT_GND) U11.6(GND)
NetC12_2: C12.2 L1.1 ; port MIX_IN
NetC14_1: C14.1 L2.2 U10.6(LO)
NetC69_1: C69.1 L14.1 ; port LO
NetC70_1: C70.1 L14.2 L15.1
NetC71_1: C71.1 L15.2 L16.1
NetC72_1: C72.1 L16.2 U10.2(IF)
NetL1_2: L1.2 U11.2(IN)
NetL2_1: L2.1 U11.4(OUT)
NetU10_3: U10.3(RF) ; port MIX_OUT

### Notes on the sheet
- Filter for LO harmonics
- (near U11) 868 MHz SAW filter
- (near U11) Mouser stocks these
- NOTE: the LO and IF ports are reversed on purpose. This was suggested by an application engineer at Minicircuits.

### Library data of the parts
C12 C14 C69-C72 = Cap Semi: Capacitor (Semiconductor SIM Model); Published: 8-Jun-2000; LatestRevisionDate: 29-May-2009; LatestRevisionNote: IPC-7351 Footprint Added.; PackageReference: C1206; Publisher: Altium Limited; PackageDescription: Chip Capacitor
L1 L2 L14-L16 = Inductor: Code_IEC: 1005; Published: 8-Jun-2000; LatestRevisionDate: 29-May-2009; LatestRevisionNote: IPC-7351 Footprint Added.; PackageReference: 0402-A; Publisher: Altium Limited; PackageDescription: Chip Inductor; Code_JEITA: 0402
U10 = ADEX-10L: Passive Mixer

## Nets that join several sheets
3.3V: LNA_and_antenna (6 pins), switch_and_PA (5 pins), Headers (5 pins), CC430 (33 pins), LO (23 pins)
GND: LNA_and_antenna (18 pins), switch_and_PA (15 pins), Headers (7 pins), CC430_tap (P3.2 P3.3 P3.4 U1.2), LO_tap (P5.2 P5.3 P5.4 U14.2), CC430 (38 pins), LO (37 pins), mixer (13 pins)
NetC11_1: CC430_tap (R7.2 U1.3), CC430 (C11.1)
NetC12_2: CC430_tap (R7.1 U1.4), mixer (C12.2 L1.1)
NetC33_2: LNA_and_antenna (C33.2), switch_and_PA (L18.2)
NetC40_2: LNA_and_antenna (C40.2 C42.1 L7.2), switch_and_PA (C80.1)
NetC65_2: LO_tap (R14.2 U14.3), LO (C65.2 R22.1)
NetC69_1: LO_tap (R14.1 U14.4), mixer (C69.1 L14.1)
NetH1_1: Headers (H1.1), CC430 (U3.5)
NetH1_2: Headers (H1.2), CC430 (U3.4)
NetH1_3: Headers (H1.3), CC430 (U3.11)
NetH1_4: Headers (H1.4), CC430 (U3.9)
NetH1_5: Headers (H1.5), CC430 (U3.23)
NetH1_6: Headers (H1.6), CC430 (U3.10)
NetR17_1: CC430 (U3.13), LO (R17.1 U8.3)
NetR18_1: CC430 (U3.12), LO (R18.1 U8.1)
NetR19_1: CC430 (U3.6), LO (R19.1 U8.2)
NetU3_3: LNA_and_antenna (U7.2), switch_and_PA (U12.2), CC430 (U3.3)
NetU10_3: switch_and_PA (U12.4), mixer (U10.3)